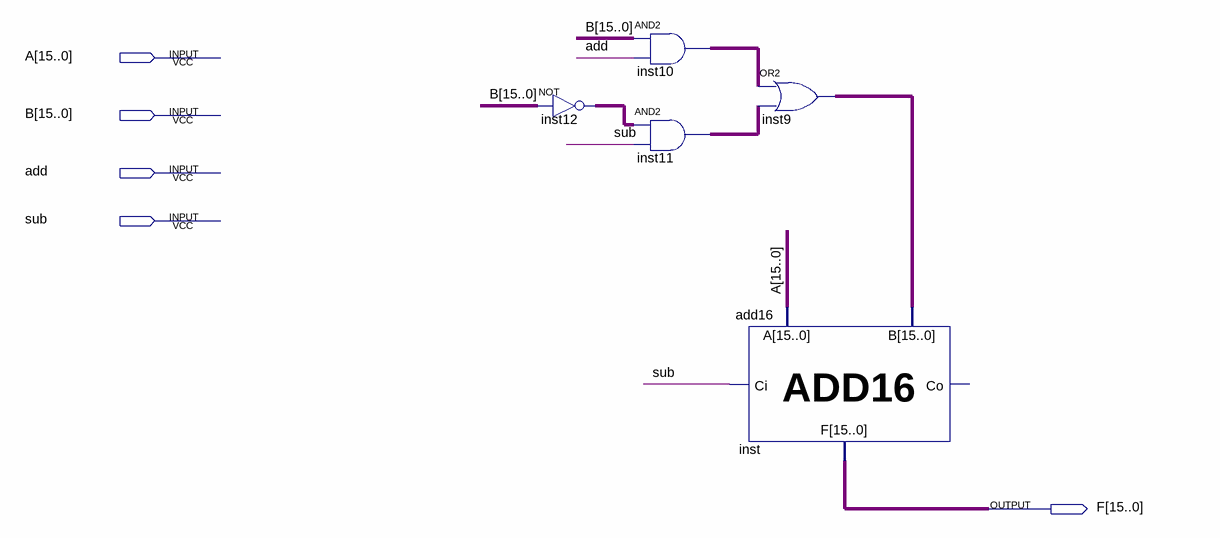
[diagram p0: schematic sheet]
// Quartus schematic add_sub16.bdf as structural Verilog: 5 symbols, 5 pins
module add_sub16 (
  input  [15:0] A,
  input  [15:0] B,
  input  add,
  input  sub,
  output [15:0] F
);

  wire [15:0] inst9_out, inst10_out, inst11_out, inst12_out;

  assign inst12_out = ~B;  // NOT inst12, 16 bits wide
  assign inst10_out = B & {16{add}};  // AND2 inst10, 16 bits wide
  assign inst11_out = inst12_out & {16{sub}};  // AND2 inst11, 16 bits wide
  assign inst9_out = inst10_out | inst11_out;  // OR2 inst9, 16 bits wide
  add16 inst (.A(A), .B(inst9_out), .Ci(sub), .F(F));  // open: Co
endmodule
